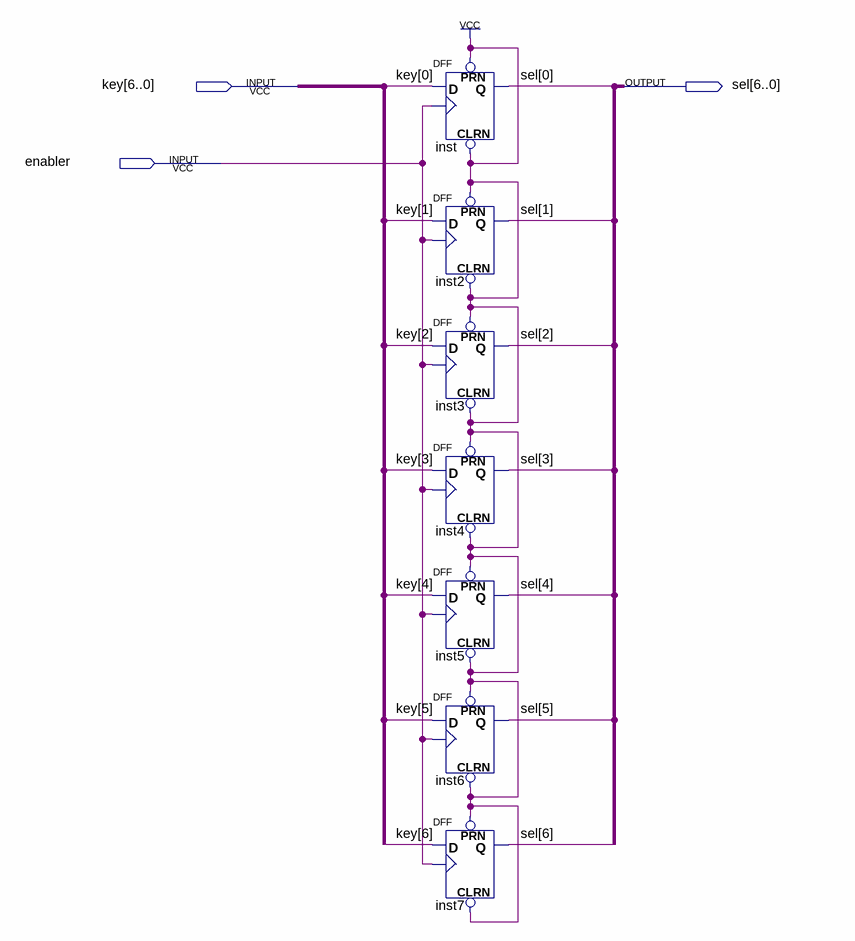
[diagram p0: schematic sheet]
// Quartus schematic keySel.bdf as structural Verilog: 7 symbols, 3 pins
module keySel (
  input  [6:0] key,
  input  enabler,
  output [6:0] sel
);

  DFF inst (.CLRN(1'b1), .CLK(enabler), .D(key[0]), .PRN(1'b1), .Q(sel[0]));
  DFF inst2 (.CLRN(1'b1), .CLK(enabler), .D(key[1]), .PRN(1'b1), .Q(sel[1]));
  DFF inst3 (.CLRN(1'b1), .CLK(enabler), .D(key[2]), .PRN(1'b1), .Q(sel[2]));
  DFF inst4 (.CLRN(1'b1), .CLK(enabler), .D(key[3]), .PRN(1'b1), .Q(sel[3]));
  DFF inst5 (.CLRN(1'b1), .CLK(enabler), .D(key[4]), .PRN(1'b1), .Q(sel[4]));
  DFF inst6 (.CLRN(1'b1), .CLK(enabler), .D(key[5]), .PRN(1'b1), .Q(sel[5]));
  DFF inst7 (.CLRN(1'b1), .CLK(enabler), .D(key[6]), .PRN(1'b1), .Q(sel[6]));
endmodule
